# Altium project STM32_main_board.PrjPcb
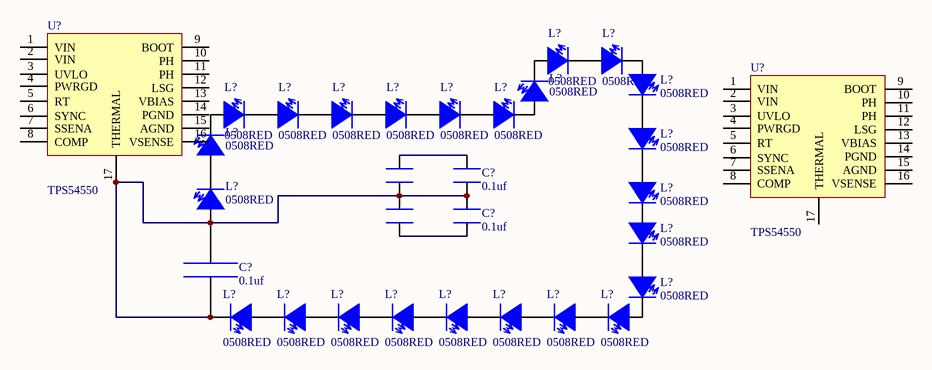
[diagram p0: stm32.SchDoc]
1 sheet, 29 parts. Net scope: global (net labels, ports and power ports of the same name join across sheets).
Board file: stm32pcb.PcbDoc

## Sheet stm32.SchDoc
size A4; SheetNumber: 1; SheetTotal: 1

### Parts
(Parts that share a designator on the sheet are numbered #1, #2 ... from top to bottom, then left to right.)
C?#1  0.1uf  [0603C]
C?#2  0.1uf  [0603C]
C?#3  0.1uf  [0603C]
L?#1  0508RED  [0508RED]
L?#2  0508RED  [0508RED]
L?#3  0508RED  [0508RED]
L?#4  0508RED  [0508RED]
L?#5  0508RED  [0508RED]
L?#6  0508RED  [0508RED]
L?#7  0508RED  [0508RED]
L?#8  0508RED  [0508RED]
L?#9  0508RED  [0508RED]
L?#10  0508RED  [0508RED]
L?#11  0508RED  [0508RED]
L?#12  0508RED  [0508RED]
L?#13  0508RED  [0508RED]
L?#14  0508RED  [0508RED]
L?#15  0508RED  [0508RED]
L?#16  0508RED  [0508RED]
L?#17  0508RED  [0508RED]
L?#18  0508RED  [0508RED]
L?#19  0508RED  [0508RED]
L?#20  0508RED  [0508RED]
L?#21  0508RED  [0508RED]
L?#22  0508RED  [0508RED]
L?#23  0508RED  [0508RED]
L?#24  0508RED  [0508RED]
U?#1  TPS54550  [TPS54550]
U?#2  TPS54550  [TPS54550]

### Nets
NetC?#1_0: C?#1.0 C?#1.2
NetC?#1_1: C?#1.1 C?#1.3 C?#2.0 C?#2.2 C?#3.0 C?#3.1 L?#14.2 L?#17.3 U?#1.17(THERMAL)
NetC?#2_1: C?#2.1 C?#2.3
NetL?#1_2: L?#1.2 L?#4.3
NetL?#1_3: L?#1.3 L?#2.2
NetL?#2_3: L?#2.3 L?#3.2
NetL?#3_3: L?#3.3 L?#11.2
NetL?#4_2: L?#4.2 L?#10.3
NetL?#5_2: L?#5.2 L?#12.3
NetL?#5_3: L?#5.3 L?#6.2
NetL?#6_3: L?#6.3 L?#7.2
NetL?#7_3: L?#7.3 L?#8.2
NetL?#8_3: L?#8.3 L?#9.2
NetL?#9_3: L?#9.3 L?#10.2
NetL?#11_3: L?#11.3 L?#13.2
NetL?#12_2: L?#12.2 L?#14.3
NetL?#15_3: L?#15.3 L?#16.2
NetL?#16_3: L?#16.3 L?#24.2
NetL?#17_2: L?#17.2 L?#18.3
NetL?#18_2: L?#18.2 L?#19.3
NetL?#19_2: L?#19.2 L?#20.3
NetL?#20_2: L?#20.2 L?#21.3
NetL?#21_2: L?#21.2 L?#22.3
NetL?#22_2: L?#22.2 L?#23.3
NetL?#23_2: L?#23.2 L?#24.3

Not connected (* = marked no-connect by the designer): L?#13 3; L?#15 2; U?#1 1(VIN) 2(VIN) 3(UVLO) 4(PWRGD) 5(RT) 6(SYNC) 7(SSENA) 8(COMP) 9(BOOT) 10(PH) 11(PH) 12(LSG) 13(VBIAS) 14(PGND) 15(AGND) 16(VSENSE); U?#2 1(VIN) 2(VIN) 3(UVLO) 4(PWRGD) 5(RT) 6(SYNC) 7(SSENA) 8(COMP) 9(BOOT) 10(PH) 11(PH) 12(LSG) 13(VBIAS) 14(PGND) 15(AGND) 16(VSENSE) 17(THERMAL)

### Library data of the parts
C?#1-C?#3 = CAP
L?#1-L?#24 = LED
U?#1 U?#2 = TPSS4550